# Altium schematic sheet elec_connector.SchDoc
size A
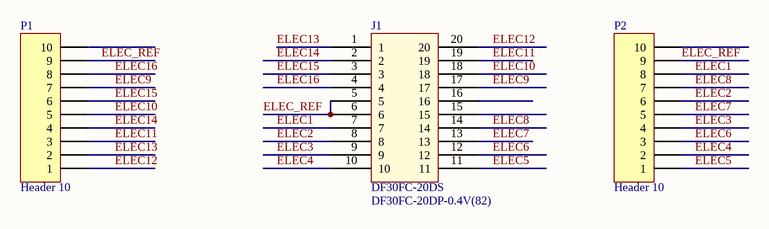
[diagram p0: elec_connector.SchDoc]

## Parts
J1  DF30FC-20DS  Manufacturer Part Number: DF30FC-20DP-0.4V(82)  [DF30FC-20DS]
P1  Header 10  [HDR1X10H]
P2  Header 10  [HDR1X10]

## Nets
ELEC1: J1.7 P2.8
ELEC2: J1.8 P2.6
ELEC3: J1.9 P2.4
ELEC4: J1.10 P2.2
ELEC5: J1.11 P2.1
ELEC6: J1.12 P2.3
ELEC7: J1.13 P2.5
ELEC8: J1.14 P2.7
ELEC9: J1.17 P1.7
ELEC10: J1.18 P1.5
ELEC11: J1.19 P1.3
ELEC12: J1.20 P1.1
ELEC13: J1.1 P1.2
ELEC14: J1.2 P1.4
ELEC15: J1.3 P1.6
ELEC16: J1.4 P1.8
ELEC_REF: J1.5 J1.6 P1.9 P2.9

Not connected (* = marked no-connect by the designer): J1 15 16; P1 10; P2 10

## Library data of the parts
J1 = DF30FC-20DP: Manufacturer: Hirose Electric Co Ltd; Description: CONN PLUG 20POS 0.4MM SMD GOLD; Connector Type: Header, Center Strip Contacts; Number of Positions: 20; Pitch: 0.016" (0.40mm); Mated Stacking Heights: 0.9mm; Supplier 1: Digi-Key; RoHS: RoHS Compliant; Category: Connectors, Interconnects; Stock 1: 11216; Pricing 1: 1=1.75, 10=1.426, 25=1.2652, 100=1.035, 250=0.874 (USD); Number of Rows: 2; Mounting Type: Surface Mount; Features: -; Contact Finish: Gold; Contact Finish Thickness: -; Packaging: Cut Tape (CT); Height Above Board: 0.031" (0.80mm); ComponentLink1URL: http://www.hirose.co.jp/cataloge_hp/e68410340.pdf; ComponentLink1Description: http://www.hirose.co.jp/cataloge_hp/e68410340.pdf; Supplier Part Number 1: H3864CT-ND
P1 P2 = Header 10: Header, 10-Pin; LatestRevisionDate: 17-Jul-2002; LatestRevisionNote: Re-released for DXP Platform.; Publisher: Altium Limited